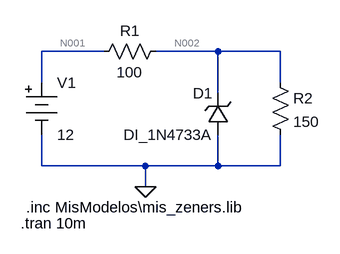
[diagram p0: schematic Zener1N4733Bateria12V.asc]
Zener1N4733Bateria12V.asc, the LTspice schematic file:
Version 4.1
SHEET 1 880 680
WIRE 112 64 16 64
WIRE 288 64 192 64
WIRE 384 64 288 64
WIRE 16 112 16 64
WIRE 384 112 384 64
WIRE 288 128 288 64
WIRE 16 240 16 192
WIRE 176 240 16 240
WIRE 288 240 288 192
WIRE 288 240 176 240
WIRE 384 240 384 192
WIRE 384 240 288 240
WIRE 176 272 176 240
FLAG 176 272 0
SYMBOL Misc\\battery 16 96 R0
SYMATTR InstName V1
SYMATTR Value 12
SYMBOL res 208 48 R90
WINDOW 0 0 56 VBottom 2
WINDOW 3 32 56 VTop 2
SYMATTR InstName R1
SYMATTR Value 100
SYMBOL res 368 96 R0
SYMATTR InstName R2
SYMATTR Value 150
SYMBOL zener 304 192 R180
WINDOW 0 24 64 Left 2
WINDOW 3 24 0 Left 2
SYMATTR InstName D1
SYMATTR Value DI_1N4733A
SYMATTR Prefix x
TEXT -8 304 Left 2 !.inc MisModelos\\mis_zeners.lib
TEXT -16 328 Left 2 !.tran 10m

The netlist it stands for:
* Zener1N4733Bateria12V.asc
V1 N001 0 12
R1 N002 N001 100
R2 N002 0 150
X§D1 0 N002 DI_1N4733A  ; pins + -
.inc MisModelos\mis_zeners.lib
.tran 10m
.backanno
.end

* Results of the author's LTspice run, read from the files saved beside the schematic
* Operating Point, zero values left out:
*   V(n001) = 12 V
*   V(n002) = 5.075 V
*   I(R1) = -69.25 mA
*   I(R2) = 33.83 mA
*   I(V1) = -69.25 mA
*   Ix(d1:1) = -35.42 mA
*   Ix(d1:2) = 35.42 mA